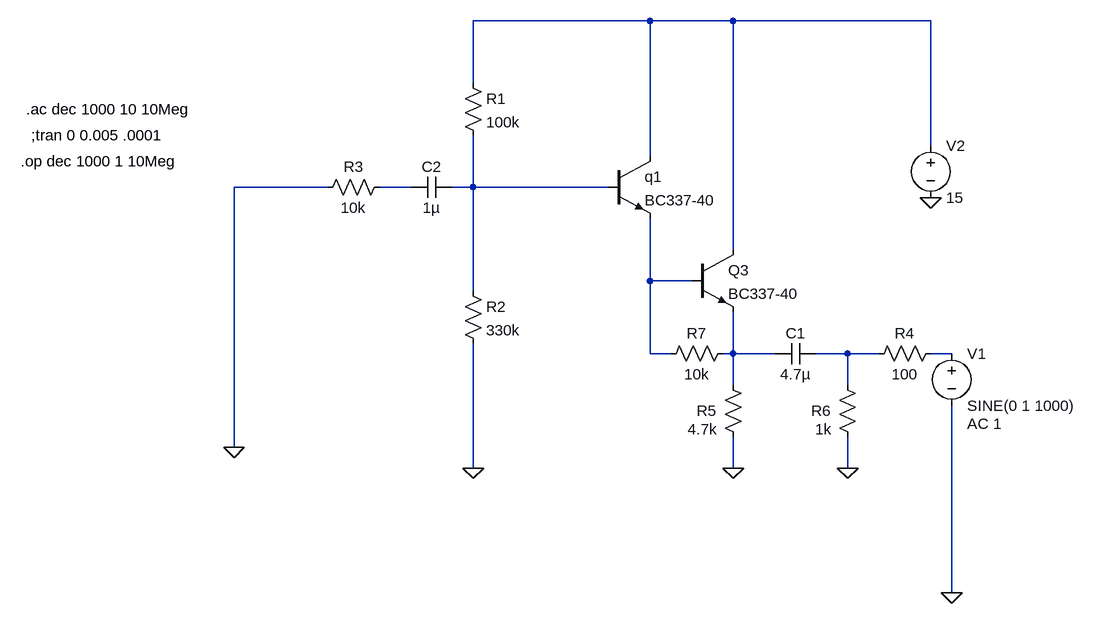
[diagram p0: schematic Simulacion_Darlington.asc]
Simulacion_Darlington.asc, the LTspice schematic file:
Version 4
SHEET 1 896 804
WIRE 224 -96 -48 -96
WIRE 352 -96 224 -96
WIRE 656 -96 352 -96
WIRE -48 0 -48 -96
WIRE 656 96 656 -96
WIRE 224 112 224 -96
WIRE -272 160 -416 160
WIRE -144 160 -192 160
WIRE -48 160 -48 80
WIRE -48 160 -80 160
WIRE 160 160 -48 160
WIRE 352 256 352 -96
WIRE 224 304 224 208
WIRE 288 304 224 304
WIRE -48 320 -48 160
WIRE 224 416 224 304
WIRE 256 416 224 416
WIRE 352 416 352 352
WIRE 352 416 336 416
WIRE 416 416 352 416
WIRE 528 416 480 416
WIRE 576 416 528 416
WIRE 688 416 656 416
WIRE 352 464 352 416
WIRE 528 464 528 416
WIRE -416 560 -416 160
WIRE -48 592 -48 400
WIRE 352 592 352 544
WIRE 528 592 528 544
WIRE 688 784 688 496
FLAG -48 592 0
FLAG 352 592 0
FLAG 528 592 0
FLAG 688 784 0
FLAG 656 176 0
FLAG -416 560 0
SYMBOL npn 160 112 R0
SYMATTR InstName q1
SYMATTR Value BC337-40
SYMBOL res -64 -16 R0
SYMATTR InstName R1
SYMATTR Value 100k
SYMBOL res -64 304 R0
SYMATTR InstName R2
SYMATTR Value 330k
SYMBOL res -176 144 R90
WINDOW 0 0 56 VBottom 2
WINDOW 3 32 56 VTop 2
SYMATTR InstName R3
SYMATTR Value 10k
SYMBOL res 368 560 R180
WINDOW 0 41 56 Left 2
WINDOW 3 40 28 Left 2
SYMATTR InstName R5
SYMATTR Value 4.7k
SYMBOL res 544 560 R180
WINDOW 0 41 56 Left 2
WINDOW 3 40 28 Left 2
SYMATTR InstName R6
SYMATTR Value 1k
SYMBOL cap 480 400 R90
WINDOW 0 0 32 VBottom 2
WINDOW 3 32 32 VTop 2
SYMATTR InstName C1
SYMATTR Value 4.7µ
SYMBOL cap -80 144 R90
WINDOW 0 0 32 VBottom 2
WINDOW 3 32 32 VTop 2
SYMATTR InstName C2
SYMATTR Value 1µ
SYMBOL voltage 688 400 R0
WINDOW 123 24 124 Left 2
WINDOW 39 0 0 Left 2
SYMATTR Value2 AC 1
SYMATTR InstName V1
SYMATTR Value SINE(0 1 1000)
SYMBOL voltage 656 80 R0
WINDOW 123 0 0 Left 2
WINDOW 39 0 0 Left 2
SYMATTR InstName V2
SYMATTR Value 15
SYMBOL res 352 400 R90
WINDOW 0 0 56 VBottom 2
WINDOW 3 32 56 VTop 2
SYMATTR InstName R7
SYMATTR Value 10k
SYMBOL res 672 400 R90
WINDOW 0 0 56 VBottom 2
WINDOW 3 32 56 VTop 2
SYMATTR InstName R4
SYMATTR Value 100
SYMBOL npn 288 256 R0
SYMATTR InstName Q3
SYMATTR Value BC337-40
TEXT -728 80 Left 2 !;tran 0 0.005 .0001
TEXT -736 40 Left 2 !.ac dec 1000 10 10Meg
TEXT -744 120 Left 2 !.op dec 1000 1 10Meg

The netlist it stands for:
* Simulacion_Darlington.asc
q1 N001 N003 N004 0 BC337-40
R1 N001 N003 100k
R2 N003 0 330k
R3 N002 0 10k
R5 0 N005 4.7k
R6 0 N006 1k
C1 N006 N005 4.7µ
C2 N003 N002 1µ
V1 N007 0 SINE(0 1 1000) AC 1
V2 N001 0 15
R7 N005 N004 10k
R4 N007 N006 100
Q3 N001 N004 N005 0 BC337-40
.model NPN NPN
.model PNP PNP
.lib standard.bjt
;tran 0 0.005 .0001
.ac dec 1000 10 10Meg
.op dec 1000 1 10Meg
.backanno
.end